# EAGLE schematic DroidOS (EAGLE 8.4.3)
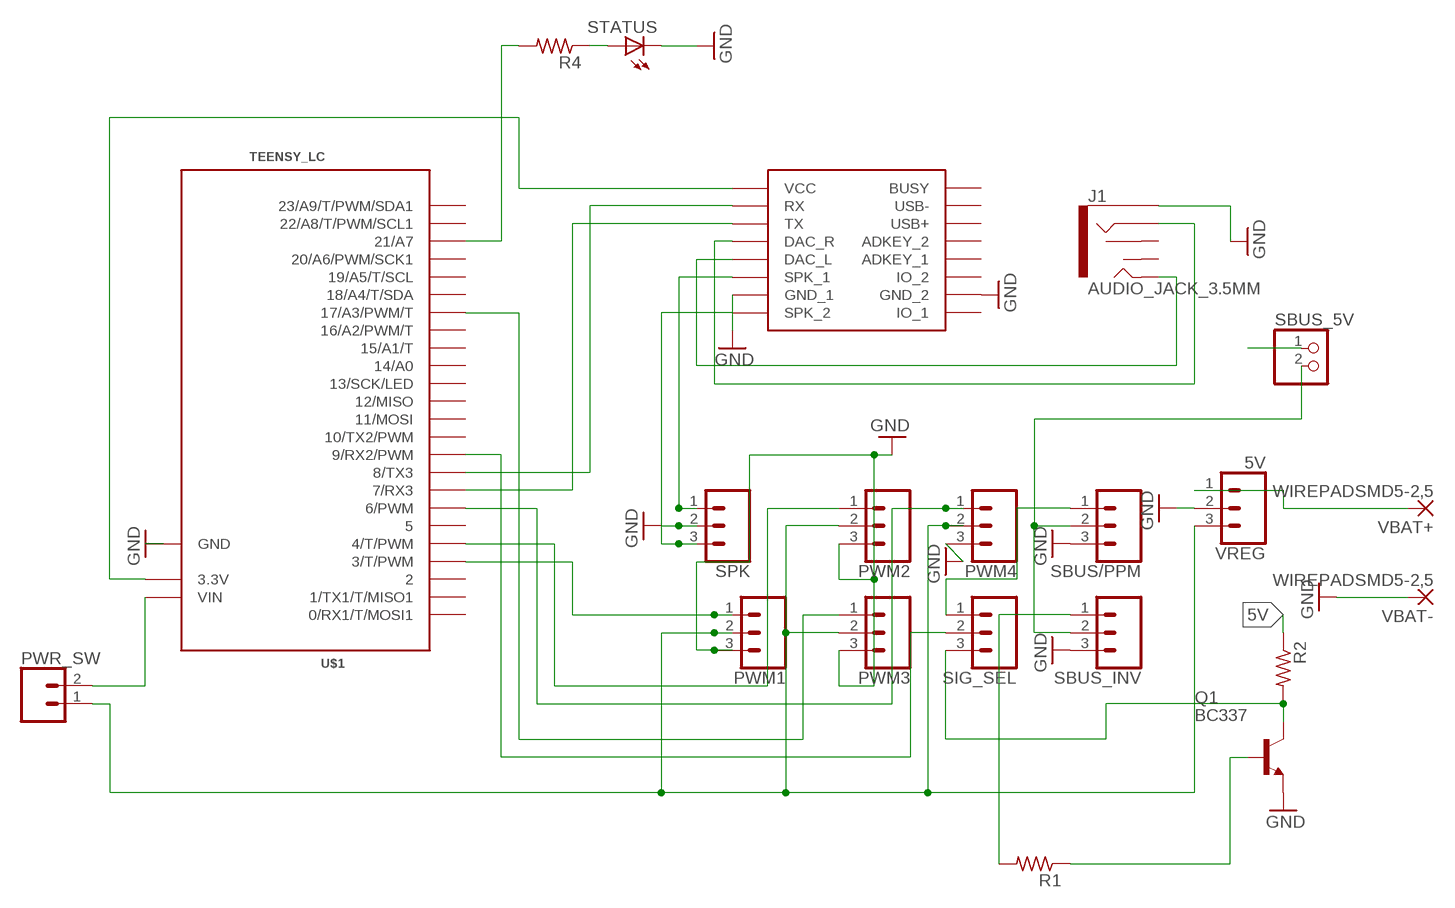
[diagram p0: schematic, sheet 1]

## Parts
J1  AUDIO_JACK_3.5MM  AUDIO_JACK_3.5MM_KIT  [AUDIO-JACK-KIT]
PWM1  CONN_03  [1X03]
PWM2  CONN_03  [1X03]
PWM3  CONN_03  [1X03]
PWM4  CONN_03  [1X03]
PWR_SW  CONN_02  [1X02]
Q1  BC337  [TO92]
R1  R-US_R0805  [R0805]
R2  R-US_R0805  [R0805]
R4  R-US_R0805  [R0805]
SBUS/PPM  CONN_03  [1X03]
SBUS_5V  PINHD-1X2  [1X02]
SBUS_INV  CONN_03  [1X03]
SIG_SEL  CONN_03  [1X03]
SPK  CONN_03  [1X03]
STATUS  LEDSML0805  [SML0805]
U$1  TEENSY_LC  TEENSY_LC_DIL  [TEENSY_3.0-3.2&LC_DIL]
U$2  DFPLAYER  [DFPLAYER]
VBAT+  WIREPADSMD5-2,5  [5-2,5]
VBAT-  WIREPADSMD5-2,5  [5-2,5]
VREG  5V  CONN_03  [1X03]

## Nets
3V+: U$1.3.3V U$2.VCC
5V: PWM1.2 PWM2.2 PWM3.2 PWM4.2 PWR_SW.1 R2.1 SBUS_5V.1 VREG.3
AUD_RX: U$1.8(8/TX3) U$2.RX
AUD_TX: U$1.7(7/RX3) U$2.TX
CTRL_SIG: SIG_SEL.2 U$1.9(9/RX2/PWM)
DAC_L: J1.TIP U$2.DAC_L
DAC_R: J1.RING U$2.DAC_R
GND: J1.SLEEVE PWM1.3 PWM2.3 PWM3.3 PWM4.3 Q1.1(E) SBUS/PPM.3 SBUS_INV.3 SPK.2 STATUS.C U$1.AGND(GND) U$1.GND U$2.GND_1 U$2.GND_2 VBAT-.1(P) VREG.2
N$1: PWR_SW.2 U$1.VIN
N$2: R4.1 STATUS.A
N$3: SBUS/PPM.2 SBUS_5V.2 SBUS_INV.2
N$4: Q1.2(B) R1.1
PWM1_SIG: PWM1.1 U$1.3(3/T/PWM)
PWM2_SIG: PWM2.1 U$1.4(4/T/PWM)
PWM3_SIG: PWM3.1 U$1.17/A3(17/A3/PWM/T)
PWM4_SIG: PWM4.1 U$1.6(6/PWM)
SBUS_INV_IN: R1.2 SBUS_INV.1
SBUS_INV_OUT: Q1.3(C) R2.2 SIG_SEL.3
SBUS_OUT: SBUS/PPM.1 SIG_SEL.1
SPK_L: SPK.1 U$2.SPK1(SPK_1)
SPK_R: SPK.3 U$2.SPK2(SPK_2)
STATUS_LED: R4.2 U$1.21/A7
VBAT [pwr]: VBAT+.1(P) VREG.1
Unconnected: J1.RSH J1.TSH U$1.0(0/RX1/T/MOSI1) U$1.1(1/TX1/T/MISO1) U$1.2 U$1.5 U$1.10(10/TX2/PWM) U$1.11(11/MOSI) U$1.12(12/MISO) U$1.13(13/SCK/LED) U$1.14/A0 U$1.15/A1(15/A1/T) U$1.16/A2(16/A2/PWM/T) U$1.18/A4(18/A4/T/SDA) U$1.19/A5(19/A5/T/SCL) U$1.20/A6(20/A6/PWM/SCK1) U$1.22/A8(22/A8/T/PWM/SCL1) U$1.23/A9(23/A9/T/PWM/SDA1) U$2.ADKEY1(ADKEY_1) U$2.ADKEY2(ADKEY_2) U$2.BUSY U$2.IO1(IO_1) U$2.IO2(IO_2) U$2.USB+ U$2.USB-

## Library data of the parts
J1 = SparkFun-Connectors:AUDIO_JACK_3.5MM: Audio Jack 3.5mm variants of PTH and SMT stereo audio jack with bypass switches. SparkFun Products: SparkFun SparkPunk Sound Kit <[https://www.sparkfun.com/products/11177]> - PTH MP3 Trigger <https://www.sparkfun.com/products/13720> -3.5mm SMD SparkFun PicoBoard <https://www.sparkfun.com/products/11888>- 2.5mm SMD; PROD_ID: CONN-08774; SF_ID: PRT-08032
PWM1-PWM4 SBUS/PPM SBUS_INV SIG_SEL SPK VREG = SparkFun-Connectors:CONN_03: Multi connection point. Often used as Generic Header-pin footprint for 0.1 inch spaced/style header connections On any of the 0.1 inch spaced packages, you can populate with these: Break Away Headers - Straight <https://www.sparkfun.com/products/116> (PRT-00116) Break Away Male Headers - Right Angle <https://www.sparkfun.com/products/553> (PRT-00553) Female Headers <https://www.sparkfun.com/products/115> (PRT-00115) Break Away Headers - Machine Pin <https://www.sparkfun.com/products/117> (PRT-00117) Break Away Female Headers - Swiss Machine Pin <https://www.sparkfun.com/products/743> (PRT-00743) Stackable Header - 3 Pin (Female, 0.1") <https://www.sparkfun.com/products/13875> (PRT-13875) For SCREWTERMINALS and SPRING TERMINALS visit here: Screw Terimnals on SparkFun.com <https://www.sparkfun.com/search/results?term=Screw+Terminals> (5mm/3.5mm/2.54mm spacing) This device is also useful as a general connection point to wire up your design to another part of your project. Our various solder wires solder well into these plated through hole pads. Hook-Up Wire - Assortment (Stranded, 22 AWG) <https://www.sparkfun.com/products/11375> (PRT-11375) Hook-Up Wire - Assortment (Solid Core, 22 AWG) <https://www.sparkfun.com/products/11367> (PRT-11367) View the entire wire category on our website here <https://www.sparkfun.com/categories/141> Special notes: Molex polarized connector foot print use with SKU : PRT-08232 with associated crimp pins and housings.
PWR_SW = SparkFun-Connectors:CONN_02: Multi connection point. Often used as Generic Header-pin footprint for 0.1 inch spaced/style header connections On any of the 0.1 inch spaced packages, you can populate with these: Break Away Headers - Straight <https://www.sparkfun.com/products/116> (PRT-00116) Break Away Male Headers - Right Angle <https://www.sparkfun.com/products/553> (PRT-00553) Female Headers <https://www.sparkfun.com/products/115> (PRT-00115) Break Away Headers - Machine Pin <https://www.sparkfun.com/products/117> (PRT-00117) Break Away Female Headers - Swiss Machine Pin <https://www.sparkfun.com/products/743> (PRT-00743) For SCREWTERMINALS and SPRING TERMINALS visit here: Screw Terimnals on SparkFun.com <https://www.sparkfun.com/search/results?term=Screw+Terminals> (5mm/3.5mm/2.54mm spacing) This device is also useful as a general connection point to wire up your design to another part of your project. Our various solder wires solder well into these plated through hole pads. Hook-Up Wire - Assortment (Stranded, 22 AWG) <https://www.sparkfun.com/products/11375> (PRT-11375) Hook-Up Wire - Assortment (Solid Core, 22 AWG) <https://www.sparkfun.com/products/11367> (PRT-11367) View the entire wire category on our website here <https://www.sparkfun.com/categories/141> Special notes: Molex polarized connector foot print use with: PRT-08233 with associated crimp pins and housings. 2.54_SCREWTERM for use with PRT-10571. 3.5mm Screw Terminal footprints for PRT-08084 5mm Screw Terminal footprints for use with PRT-08432
Q1 = transistor-npn:BC337*: NPN Transistor
R1 R2 R4 = resistor:R-US_: RESISTOR, American symbol
SBUS_5V = pinhead:PINHD-1X2: PIN HEADER
STATUS = led:LED: LED OSRAM: - CHIPLED LG R971, LG N971, LY N971, LG Q971, LY Q971, LO R971, LY R971 LH N974, LH R974 LS Q976, LO Q976, LY Q976 LO Q996 - Hyper CHIPLED LW Q18S LB Q993, LB Q99A, LB R99A - SideLED LS A670, LO A670, LY A670, LG A670, LP A670 LB A673, LV A673, LT A673, LW A673 LH A674 LY A675 LS A676, LA A676, LO A676, LY A676, LW A676 LS A679, LY A679, LG A679 - Hyper Micro SIDELED® LS Y876, LA Y876, LO Y876, LY Y876 LT Y87S - SmartLED LW L88C, LW L88S LB L89C, LB L89S, LG L890 LS L89K, LO L89K, LY L89K LS L896, LA L896, LO L896, LY L896 - TOPLED LS T670, LO T670, LY T670, LG T670, LP T670 LSG T670, LSP T670, LSY T670, LOP T670, LYG T670 LG T671, LOG T671, LSG T671 LB T673, LV T673, LT T673, LW T673 LH T674 LS T676, LA T676, LO T676, LY T676, LB T676, LH T676, LSB T676, LW T676 LB T67C, LV T67C, LT T67C, LS T67K, LO T67K, LY T67K, LW E67C LS E67B, LA E67B, LO E67B, LY E67B, LB E67C, LV E67C, LT E67C LW T67C LS T679, LY T679, LG T679 LS T770, LO T770, LY T770, LG T770, LP T770 LB T773, LV T773, LT T773, LW T773 LH T774 LS E675, LA E675, LY E675, LS T675 LS T776, LA T776, LO T776, LY T776, LB T776 LHGB T686 LT T68C, LB T68C - Hyper Mini TOPLED® LB M676 - Mini TOPLED Santana® LG M470 LS M47K, LO M47K, LY M47K Source: http://www.osram.convergy.de LUXEON: - LUMILED® LXK2-PW12-R00, LXK2-PW12-S00, LXK2-PW14-U00, LXK2-PW14-V00 LXK2-PM12-R00, LXK2-PM12-S00, LXK2-PM14-U00 LXK2-PE12-Q00, LXK2-PE12-R00, LXK2-PE12-S00, LXK2-PE14-T00, LXK2-PE14-U00 LXK2-PB12-K00, LXK2-PB12-L00, LXK2-PB12-M00, LXK2-PB14-N00, LXK2-PB14-P00, LXK2-PB14-Q00 LXK2-PR12-L00, LXK2-PR12-M00, LXK2-PR14-Q00, LXK2-PR14-R00 LXK2-PD12-Q00, LXK2-PD12-R00, LXK2-PD12-S00 LXK2-PH12-R00, LXK2-PH12-S00 LXK2-PL12-P00, LXK2-PL12-Q00, LXK2-PL12-R00 Source: www.luxeon.com KINGBRIGHT: KA-3528ASYC Source: www.kingbright.com
U$1 = Teensy_3_and_LC_Series_Boards_v1.4:TEENSY_LC_DIL
U$2 = DFPlayer_v1:DFPLAYER
VBAT+ VBAT- = wirepad:WIREPAD: Wire PAD connect wire on PCB

## Net classes
0 default: width 0.356 mm, drill 0.381 mm, clearance 0.254 mm
1 pwr: width 0.61 mm, drill 0.381 mm, clearance 0.254 mm